# Altium schematic sheet 51-BLANK 121-140.SchDoc
size 594 x 420 mm
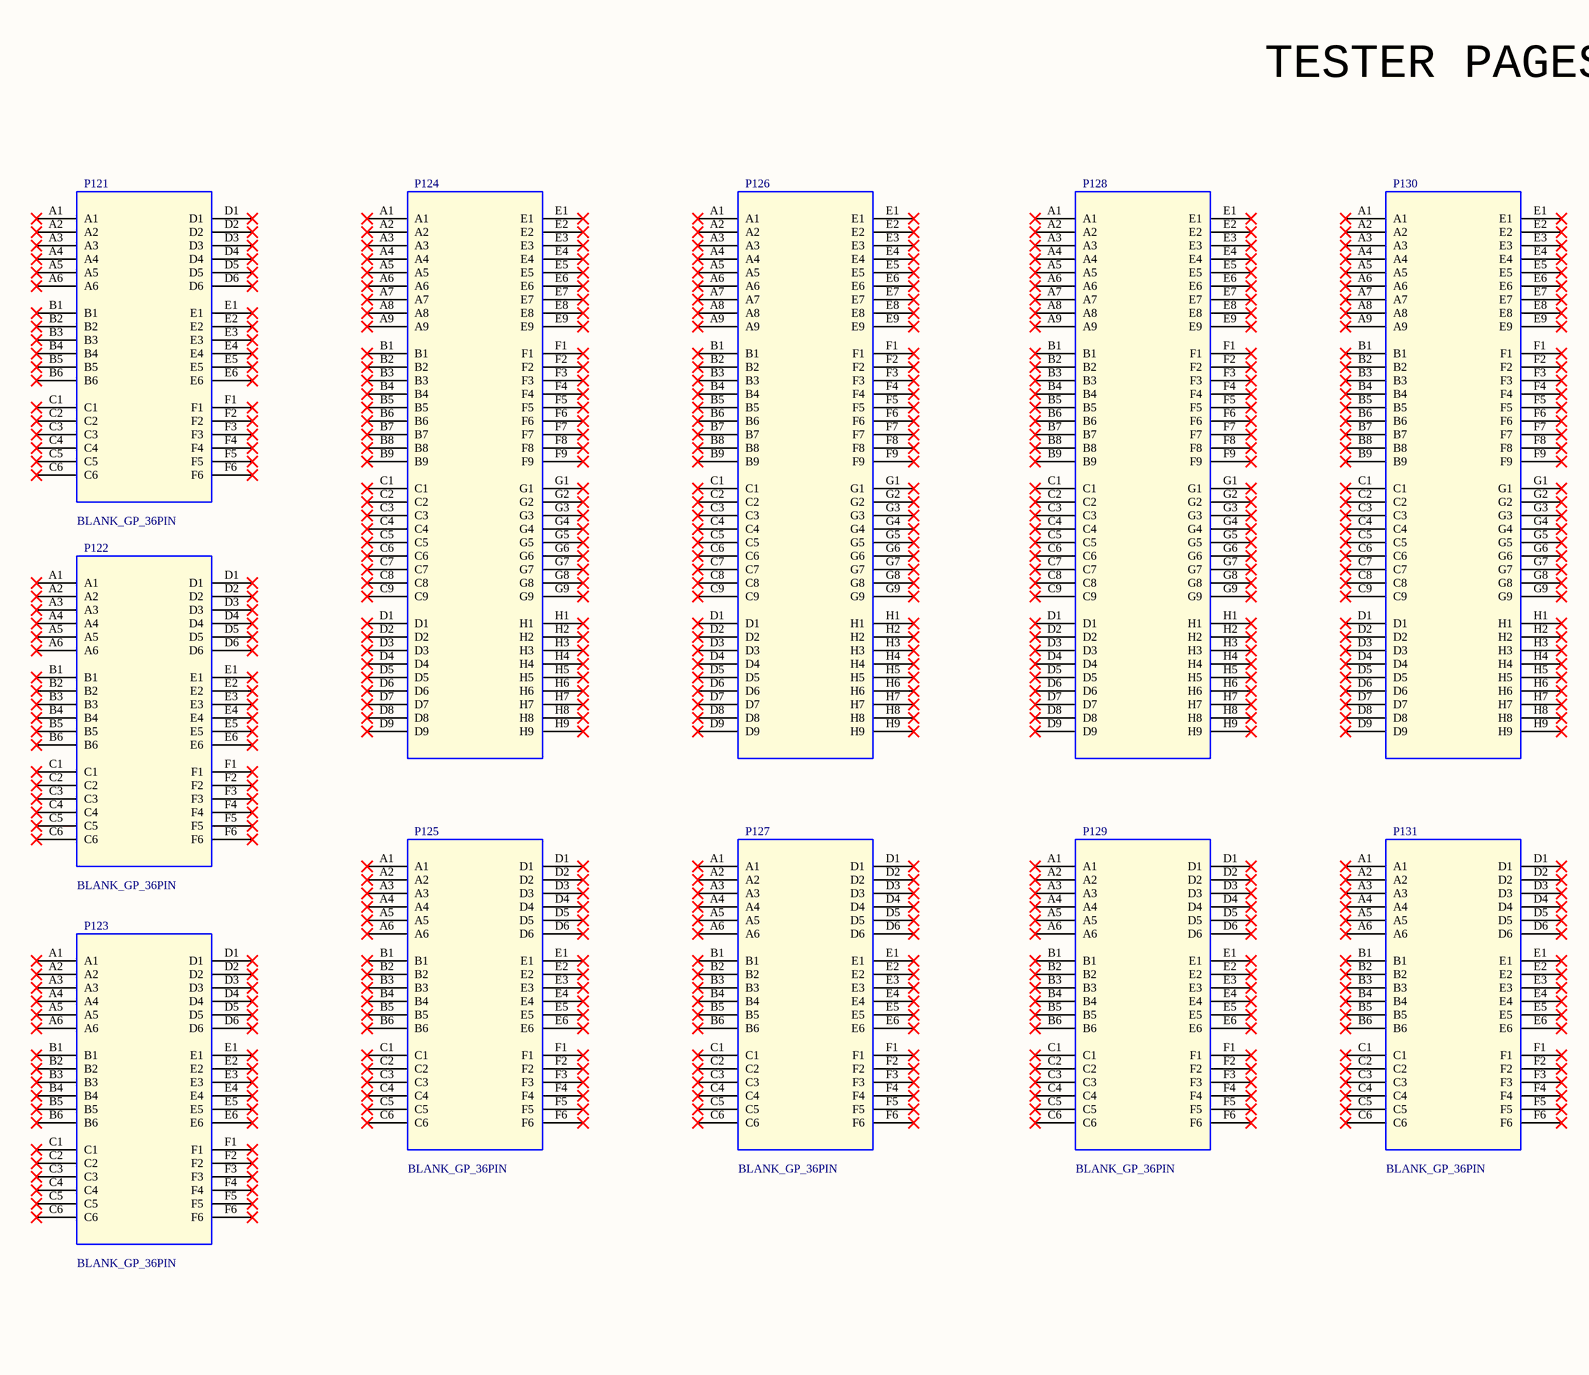
[diagram p0: 51-BLANK 121-140.SchDoc, left]
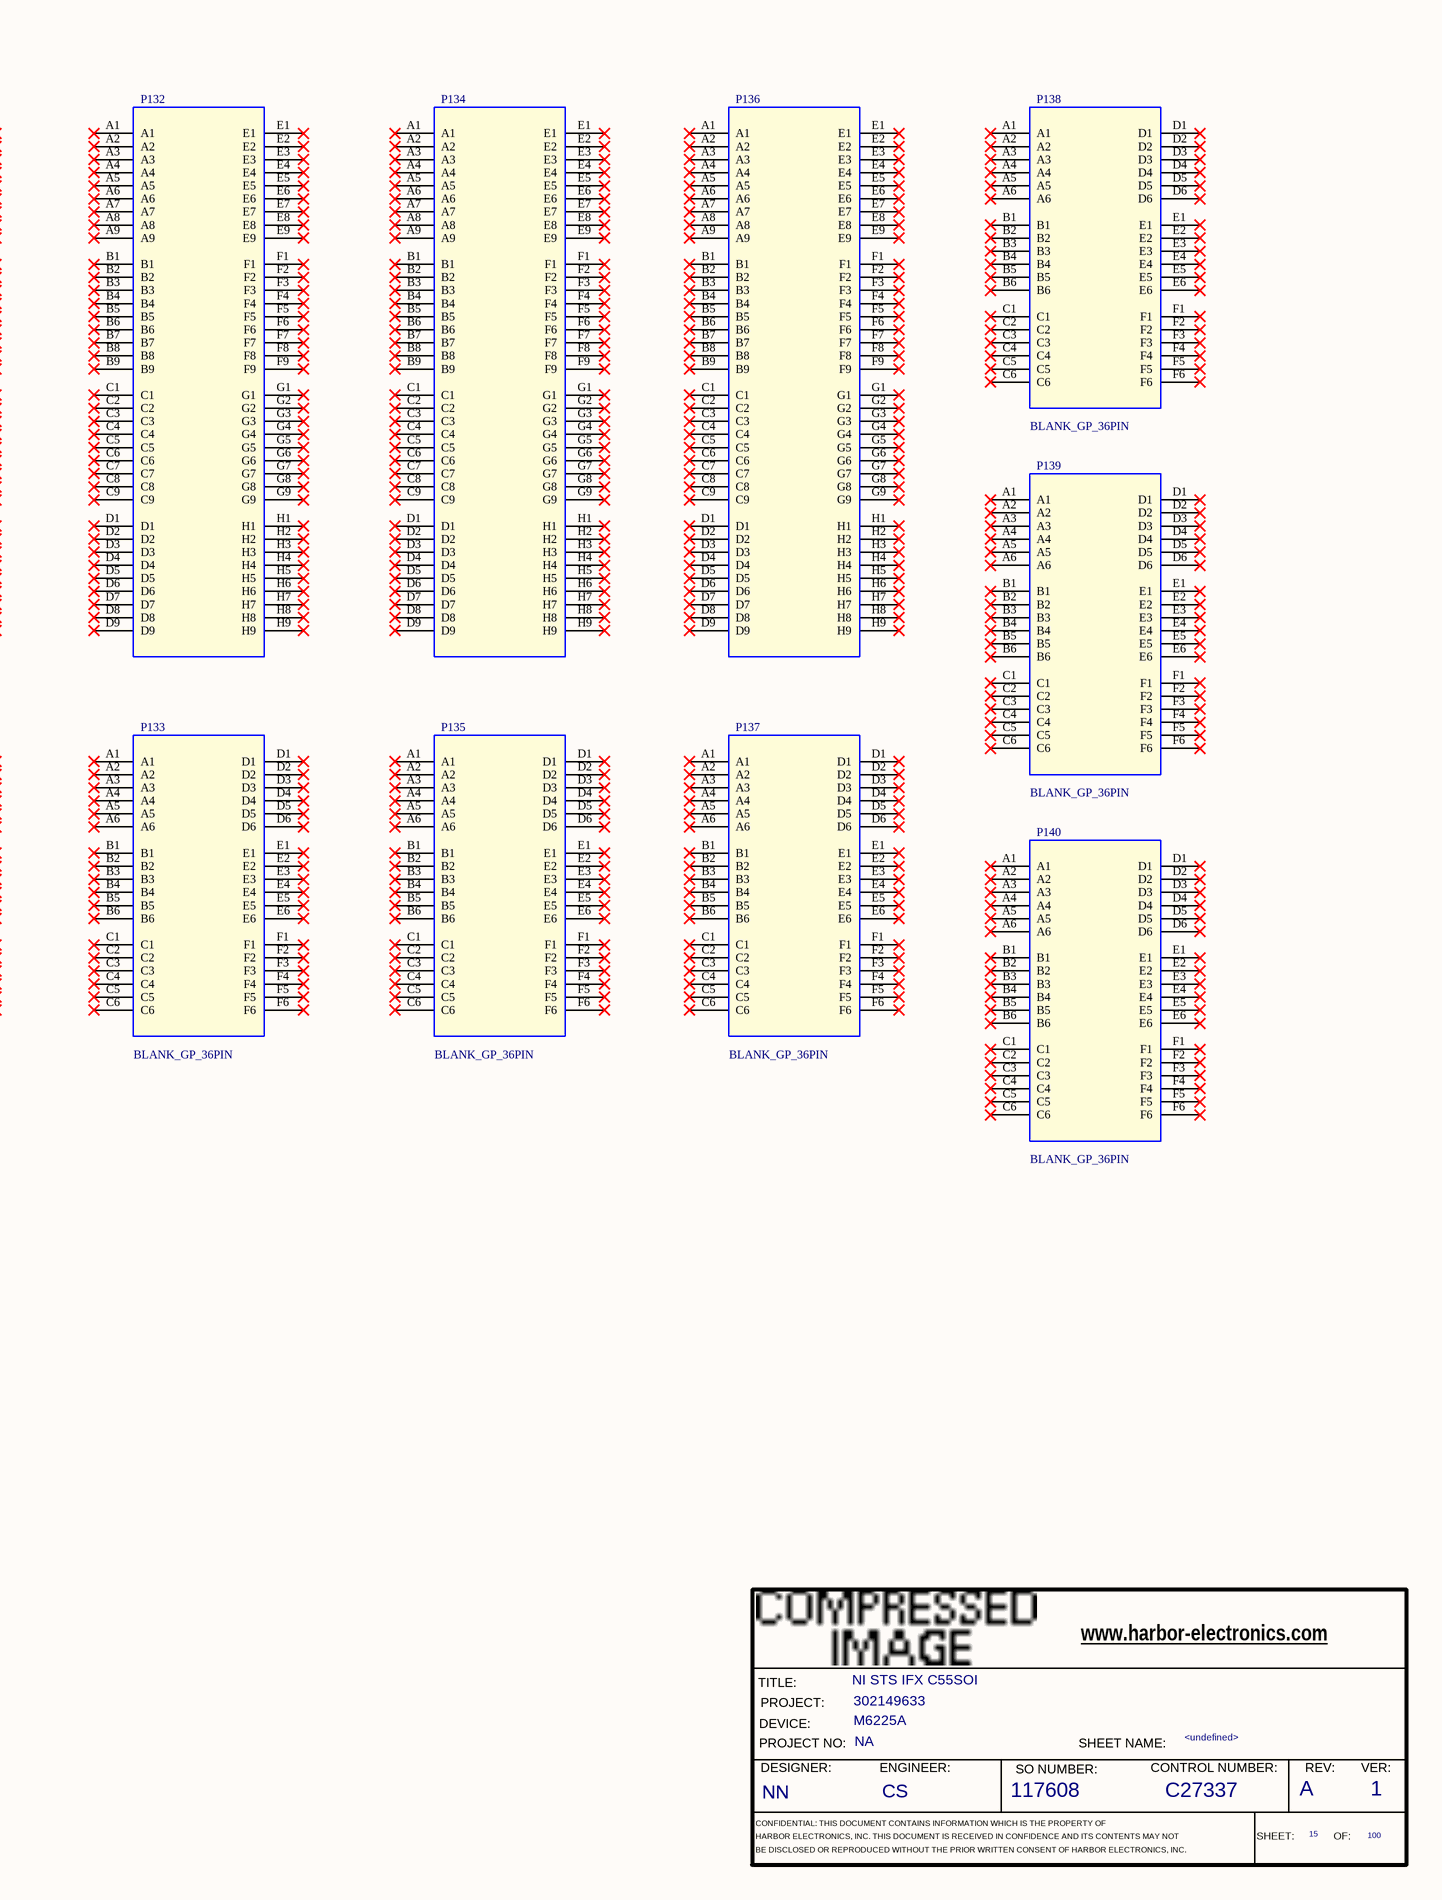
[diagram p1: 51-BLANK 121-140.SchDoc, right]

## Parts
*  RevCode: A  Title: NI STS IFX C55SOI  Page Number: 15  Page Count: 100  Engineer: CS  Designer: NN  SO Number: 117608  Control Number: C27337  Version: 1  Page Name: <undefined>  PROJECT: 302149633  DEVICE: M6225A  PROJECT NO.: NA  (hidden comment: HE_DEFAULT)  (graphical)
P121  BLANK_GP_36PIN  [285092A-08_36PIN_NOVIA]
P122  BLANK_GP_36PIN  [285092A-08_36PIN_NOVIA]
P123  BLANK_GP_36PIN  [285092A-08_36PIN_NOVIA]
P124  (no value)  [285092A-08_72PIN_NOVIA]
P125  BLANK_GP_36PIN  [285092A-08_36PIN_NOVIA]
P126  (no value)  [285092A-08_72PIN_NOVIA]
P127  BLANK_GP_36PIN  [285092A-08_36PIN_NOVIA]
P128  (no value)  [285092A-08_72PIN_NOVIA]
P129  BLANK_GP_36PIN  [285092A-08_36PIN_NOVIA]
P130  (no value)  [285092A-08_72PIN_NOVIA]
P131  BLANK_GP_36PIN  [285092A-08_36PIN_NOVIA]
P132  (no value)  [285092A-08_72PIN_NOVIA]
P133  BLANK_GP_36PIN  [285092A-08_36PIN_NOVIA]
P134  (no value)  [285092A-08_72PIN_NOVIA]
P135  BLANK_GP_36PIN  [285092A-08_36PIN_NOVIA]
P136  (no value)  [285092A-08_72PIN_NOVIA]
P137  BLANK_GP_36PIN  [285092A-08_36PIN_NOVIA]
P138  BLANK_GP_36PIN  [285092A-08_36PIN_NOVIA]
P139  BLANK_GP_36PIN  [285092A-08_36PIN_NOVIA]
P140  BLANK_GP_36PIN  [285092A-08_36PIN_NOVIA]

## Nets

Not connected (* = marked no-connect by the designer): P121 A1* A2* A3* A4* A5* A6* B1* B2* B3* B4* B5* B6* C1* C2* C3* C4* C5* C6* D1* D2* D3* D4* D5* D6* E1* E2* E3* E4* E5* E6* F1* F2* F3* F4* F5* F6*; P122 A1* A2* A3* A4* A5* A6* B1* B2* B3* B4* B5* B6* C1* C2* C3* C4* C5* C6* D1* D2* D3* D4* D5* D6* E1* E2* E3* E4* E5* E6* F1* F2* F3* F4* F5* F6*; P123 A1* A2* A3* A4* A5* A6* B1* B2* B3* B4* B5* B6* C1* C2* C3* C4* C5* C6* D1* D2* D3* D4* D5* D6* E1* E2* E3* E4* E5* E6* F1* F2* F3* F4* F5* F6*; P124 A1* A2* A3* A4* A5* A6* A7* A8* A9* B1* B2* B3* B4* B5* B6* B7* B8* B9* C1* C2* C3* C4* C5* C6* C7* C8* C9* D1* D2* D3* D4* D5* D6* D7* D8* D9* E1* E2* E3* E4* E5* E6* E7* E8* E9* F1* F2* F3* F4* F5* F6* F7* F8* F9* G1* G2* G3* G4* G5* G6* G7* G8* G9* H1* H2* H3* H4* H5* H6* H7* H8* H9*; P125 A1* A2* A3* A4* A5* A6* B1* B2* B3* B4* B5* B6* C1* C2* C3* C4* C5* C6* D1* D2* D3* D4* D5* D6* E1* E2* E3* E4* E5* E6* F1* F2* F3* F4* F5* F6*; P126 A1* A2* A3* A4* A5* A6* A7* A8* A9* B1* B2* B3* B4* B5* B6* B7* B8* B9* C1* C2* C3* C4* C5* C6* C7* C8* C9* D1* D2* D3* D4* D5* D6* D7* D8* D9* E1* E2* E3* E4* E5* E6* E7* E8* E9* F1* F2* F3* F4* F5* F6* F7* F8* F9* G1* G2* G3* G4* G5* G6* G7* G8* G9* H1* H2* H3* H4* H5* H6* H7* H8* H9*; P127 A1* A2* A3* A4* A5* A6* B1* B2* B3* B4* B5* B6* C1* C2* C3* C4* C5* C6* D1* D2* D3* D4* D5* D6* E1* E2* E3* E4* E5* E6* F1* F2* F3* F4* F5* F6*; P128 A1* A2* A3* A4* A5* A6* A7* A8* A9* B1* B2* B3* B4* B5* B6* B7* B8* B9* C1* C2* C3* C4* C5* C6* C7* C8* C9* D1* D2* D3* D4* D5* D6* D7* D8* D9* E1* E2* E3* E4* E5* E6* E7* E8* E9* F1* F2* F3* F4* F5* F6* F7* F8* F9* G1* G2* G3* G4* G5* G6* G7* G8* G9* H1* H2* H3* H4* H5* H6* H7* H8* H9*; P129 A1* A2* A3* A4* A5* A6* B1* B2* B3* B4* B5* B6* C1* C2* C3* C4* C5* C6* D1* D2* D3* D4* D5* D6* E1* E2* E3* E4* E5* E6* F1* F2* F3* F4* F5* F6*; P130 A1* A2* A3* A4* A5* A6* A7* A8* A9* B1* B2* B3* B4* B5* B6* B7* B8* B9* C1* C2* C3* C4* C5* C6* C7* C8* C9* D1* D2* D3* D4* D5* D6* D7* D8* D9* E1* E2* E3* E4* E5* E6* E7* E8* E9* F1* F2* F3* F4* F5* F6* F7* F8* F9* G1* G2* G3* G4* G5* G6* G7* G8* G9* H1* H2* H3* H4* H5* H6* H7* H8* H9*; P131 A1* A2* A3* A4* A5* A6* B1* B2* B3* B4* B5* B6* C1* C2* C3* C4* C5* C6* D1* D2* D3* D4* D5* D6* E1* E2* E3* E4* E5* E6* F1* F2* F3* F4* F5* F6*; P132 A1* A2* A3* A4* A5* A6* A7* A8* A9* B1* B2* B3* B4* B5* B6* B7* B8* B9* C1* C2* C3* C4* C5* C6* C7* C8* C9* D1* D2* D3* D4* D5* D6* D7* D8* D9* E1* E2* E3* E4* E5* E6* E7* E8* E9* F1* F2* F3* F4* F5* F6* F7* F8* F9* G1* G2* G3* G4* G5* G6* G7* G8* G9* H1* H2* H3* H4* H5* H6* H7* H8* H9*; P133 A1* A2* A3* A4* A5* A6* B1* B2* B3* B4* B5* B6* C1* C2* C3* C4* C5* C6* D1* D2* D3* D4* D5* D6* E1* E2* E3* E4* E5* E6* F1* F2* F3* F4* F5* F6*; P134 A1* A2* A3* A4* A5* A6* A7* A8* A9* B1* B2* B3* B4* B5* B6* B7* B8* B9* C1* C2* C3* C4* C5* C6* C7* C8* C9* D1* D2* D3* D4* D5* D6* D7* D8* D9* E1* E2* E3* E4* E5* E6* E7* E8* E9* F1* F2* F3* F4* F5* F6* F7* F8* F9* G1* G2* G3* G4* G5* G6* G7* G8* G9* H1* H2* H3* H4* H5* H6* H7* H8* H9*; P135 A1* A2* A3* A4* A5* A6* B1* B2* B3* B4* B5* B6* C1* C2* C3* C4* C5* C6* D1* D2* D3* D4* D5* D6* E1* E2* E3* E4* E5* E6* F1* F2* F3* F4* F5* F6*; P136 A1* A2* A3* A4* A5* A6* A7* A8* A9* B1* B2* B3* B4* B5* B6* B7* B8* B9* C1* C2* C3* C4* C5* C6* C7* C8* C9* D1* D2* D3* D4* D5* D6* D7* D8* D9* E1* E2* E3* E4* E5* E6* E7* E8* E9* F1* F2* F3* F4* F5* F6* F7* F8* F9* G1* G2* G3* G4* G5* G6* G7* G8* G9* H1* H2* H3* H4* H5* H6* H7* H8* H9*; P137 A1* A2* A3* A4* A5* A6* B1* B2* B3* B4* B5* B6* C1* C2* C3* C4* C5* C6* D1* D2* D3* D4* D5* D6* E1* E2* E3* E4* E5* E6* F1* F2* F3* F4* F5* F6*; P138 A1* A2* A3* A4* A5* A6* B1* B2* B3* B4* B5* B6* C1* C2* C3* C4* C5* C6* D1* D2* D3* D4* D5* D6* E1* E2* E3* E4* E5* E6* F1* F2* F3* F4* F5* F6*; P139 A1* A2* A3* A4* A5* A6* B1* B2* B3* B4* B5* B6* C1* C2* C3* C4* C5* C6* D1* D2* D3* D4* D5* D6* E1* E2* E3* E4* E5* E6* F1* F2* F3* F4* F5* F6*; P140 A1* A2* A3* A4* A5* A6* B1* B2* B3* B4* B5* B6* C1* C2* C3* C4* C5* C6* D1* D2* D3* D4* D5* D6* E1* E2* E3* E4* E5* E6* F1* F2* F3* F4* F5* F6*

## Notes on the sheet
- TESTER PAGES
- (in symbol HE_DEFAULT) www.harbor-electronics.com; TITLE:; PROJECT:; DEVICE:; PROJECT NO:; SHEET NAME:; DESIGNER:; ENGINEER:; SO NUMBER:; CONTROL NUMBER:; REV:; VER:; CONFIDENTIAL: THIS DOCUMENT CONTAINS INFORMATION WHICH IS THE PROPERTY OF; HARBOR ELECTRONICS, INC. THIS DOCUMENT IS RECEIVED IN CONFIDENCE AND ITS CONTENTS MAY NOT; SHEET:; OF:; BE DISCLOSED OR REPRODUCED WITHOUT THE PRIOR WRITTEN CONSENT OF HARBOR ELECTRONICS, INC.

## Library data of the parts
* = HE_DEFAULT: Page Size: X; OrgAddr4: Fax: +1 602-431-9633; OrgAddr1: 4050 E. Cotton Center Blvd., Suite 33; OrgAddr2: Phoenix, Arizona 85040 U.S.A.; OrgAddr3: Phone: +1 602-438-1112; Doc: <Title Name>; OrgName: HARBOR
P121-P123 P125 P127 P129 P131 P133 P135 P137-P140 = BLANK_GP_36PIN: ALT_SYMBOLS: 285092A-08_36PIN; PCB Footprint: 285092A-08_36PIN_NOVIA
P124 P126 P128 P130 P132 P134 P136 = BLANK_COAX_72PIN: ALT_SYMBOLS: 285092A-08_72PIN; PCB Footprint: 285092A-08_72PIN_NOVIA